# EAGLE design BMSafeMaster (EAGLE 5.08)
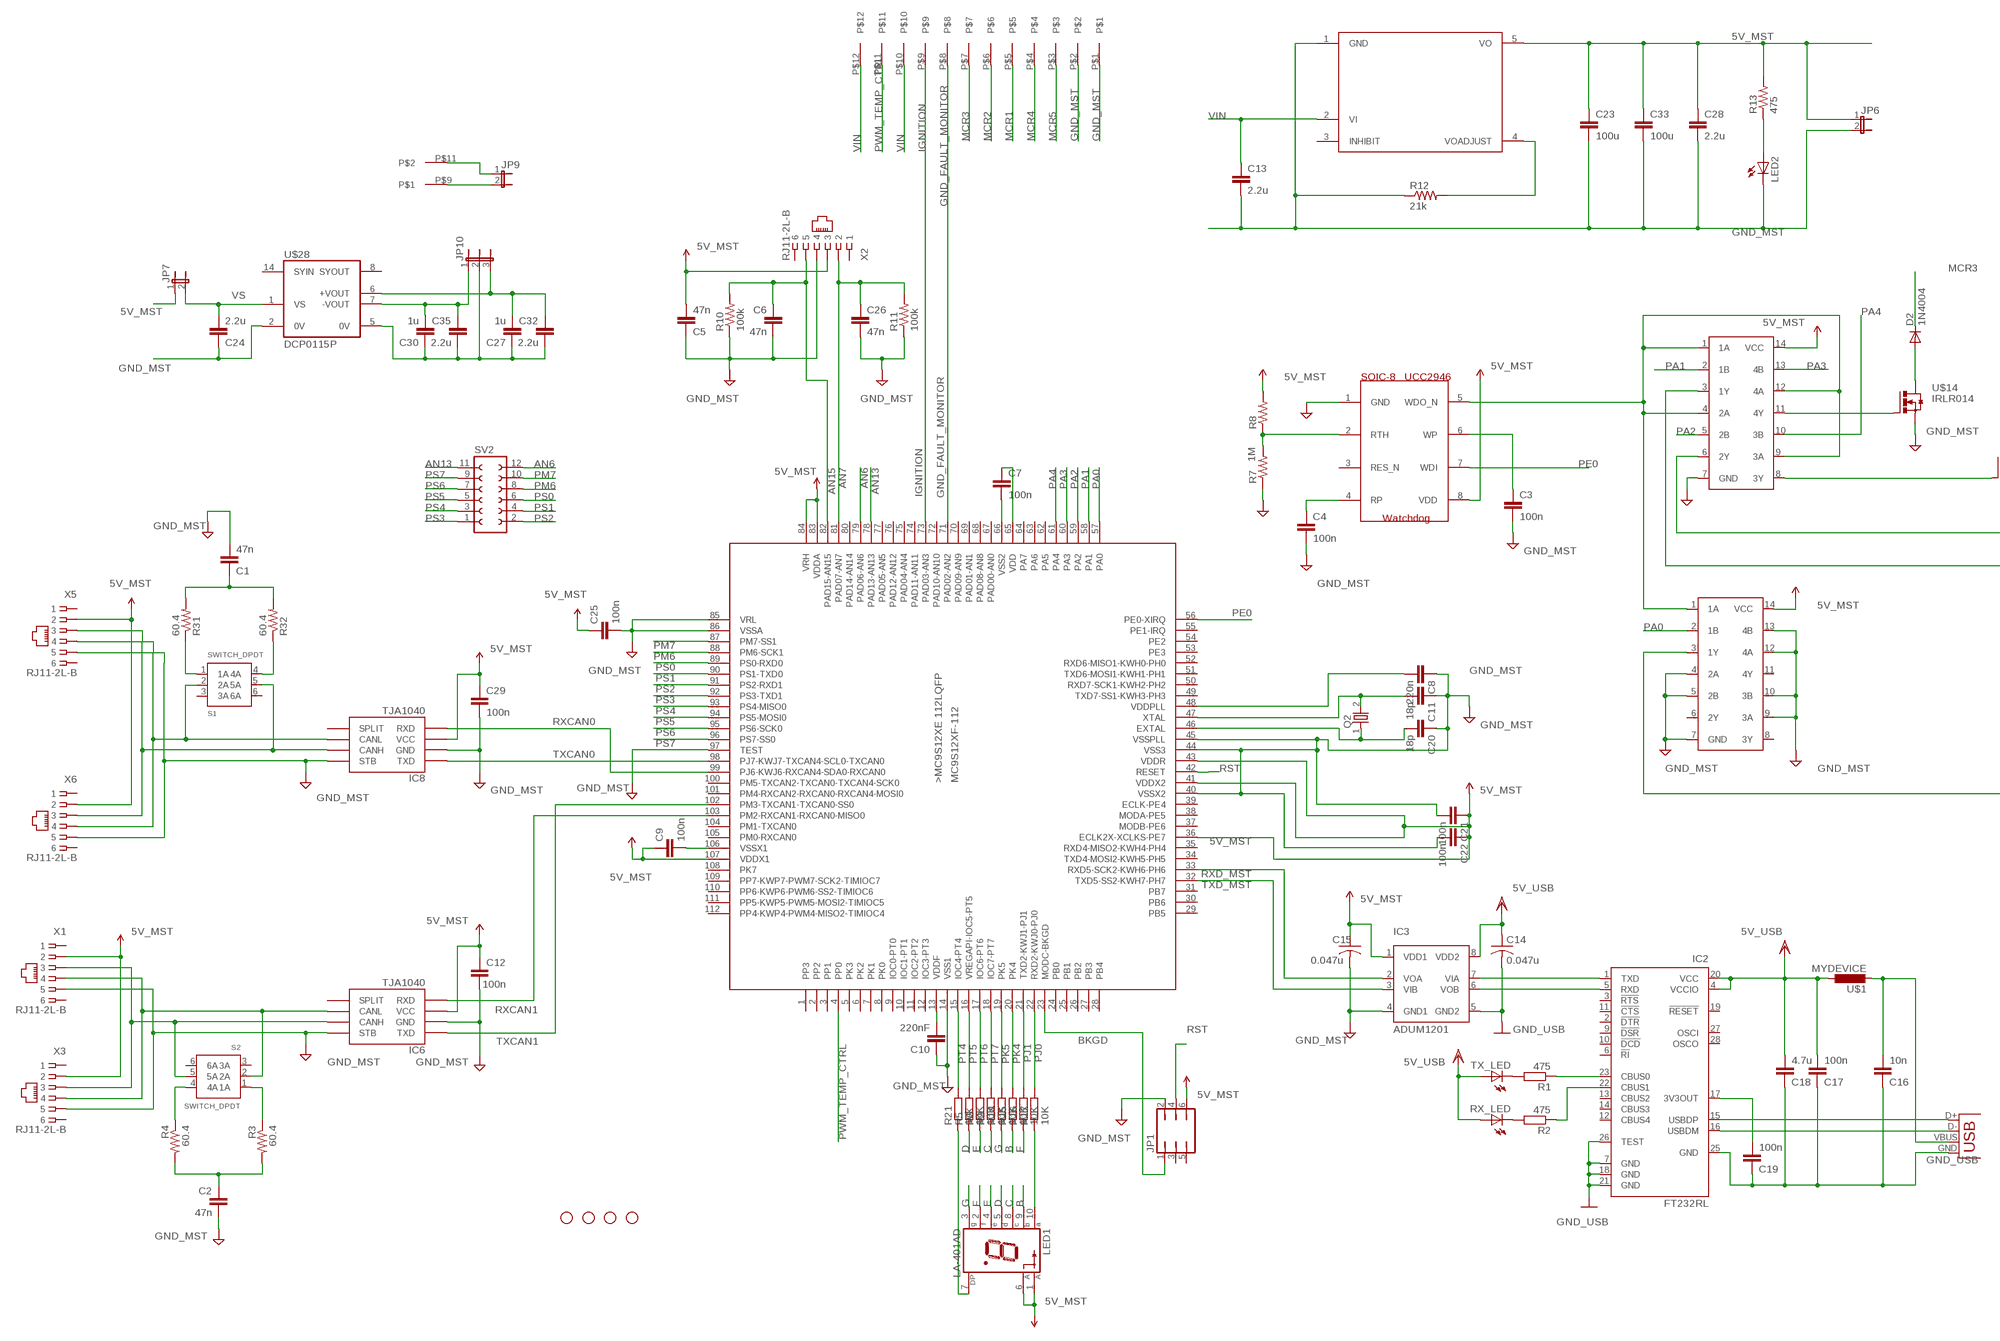
[diagram p0: schematic, sheet 1, part 1 of 2]
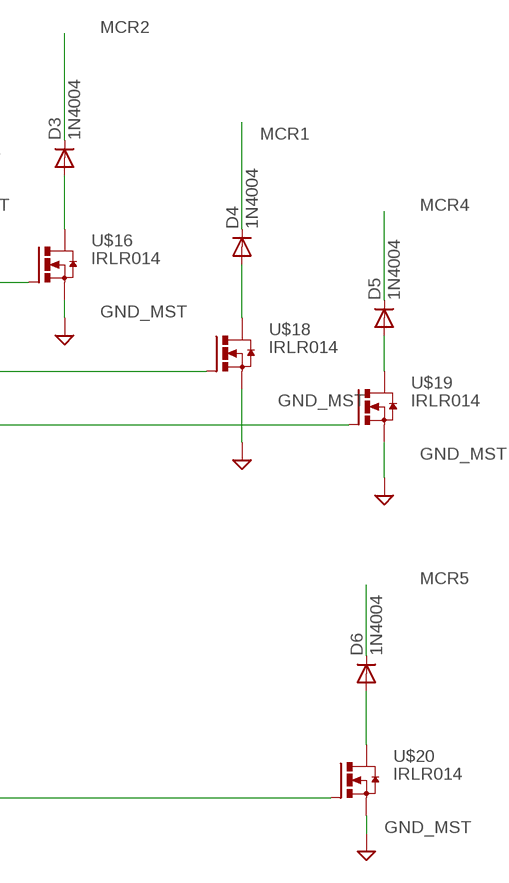
[diagram p1: schematic, sheet 1, part 2 of 2]

## Parts
C1  47n  C-EUC0805  [C0805]
C2  47n  C-EUC0805  [C0805]
C3  100n  C-EUC0805  [C0805]
C4  100n  C-EUC0805  [C0805]
C5  47n  C-EUC0805  [C0805]
C6  47n  C-EUC0805  [C0805]
C7  100n  C-EUC0805  [C0805]
C8  220n  C-EUC0805  [C0805]
C9  100n  C-EUC0805  [C0805]
C10  220nF  C-EUC0805  [C0805]
C11  18p  C-EUC0805  [C0805]
C12  100n  C-EUC0805  [C0805]
C13  2.2u  C-EUC1210  [C1210]
C14  0.047u  C-USC0805  [C0805]
C15  0.047u  C-USC0805  [C0805]
C16  10n  C-EUC0805  [C0805]
C17  100n  C-EUC0805  [C0805]
C18  4.7u  C-EUC1206  [C1206]
C19  100n  C-EUC0805  [C0805]
C20  18p  C-EUC0805  [C0805]
C21  100n  C-EUC0805  [C0805]
C22  100n  C-EUC0805  [C0805]
C23  100u  P12924  [EEU-FM1E101]
C24  2.2u  C-EUC1210  [C1210]
C25  100n  C-EUC0805  [C0805]
C26  47n  C-EUC0805  [C0805]
C27  1u  C-EU050-024X044  [C050-024X044]
C28  2.2u  C-EUC1210  [C1210]
C29  100n  C-EUC0805  [C0805]
C30  1u  C-EU050-024X044  [C050-024X044]
C32  2.2u  C-EUC1210  [C1210]
C33  100u  P12924  [EEU-FM1E101]
C35  2.2u  C-EUC1210  [C1210]
D2  1N4004  [DO41-10]
D3  1N4004  [DO41-10]
D4  1N4004  [DO41-10]
D5  1N4004  [DO41-10]
D6  1N4004  [DO41-10]
IC2  FT232RL  [SSOP28]
IC3  ADUM1201  [SOIC]
IC5  MC9S12XF-112  [SQFP-S-20X20-112]
IC6  TJA1040  [SO8]
IC8  TJA1040  [SO8]
J1  SCREWLESS_TERM_BLK2V2  [SCREWLESS2]
JP1  JP3Q  [JP3Q]
JP2  STAND-OFF  [STAND-OFF]
JP3  STAND-OFF  [STAND-OFF]
JP4  STAND-OFF  [STAND-OFF]
JP5  STAND-OFF  [STAND-OFF]
JP6  JP1E  [JP1]
JP7  JP1E  [JP1]
JP9  JP1E  [JP1]
JP10  JP2E  [JP2]
LED1  LA-401AD  [LA-401]
LED2  LEDSMT1206  [1206]
Q2  CSM-7X  [CSM-7X]
R1  475  R-EU_R0805  [R0805]
R2  475  R-EU_R0805  [R0805]
R3  60.4  R-US_R1206  [R1206]
R4  60.4  R-US_R1206  [R1206]
R5  10K  R-EU_R0805  [R0805]
R6  10K  R-EU_R0805  [R0805]
R7  1M  R-US_R0805  [R0805]
R8  1M  R-US_R0805  [R0805]
R9  10K  R-EU_R0805  [R0805]
R10  100k  R-US_R0805  [R0805]
R11  100k  R-US_R0805  [R0805]
R12  21k  R-US_R0805  [R0805]
R13  475  R-US_R0805  [R0805]
R14  10K  R-EU_R0805  [R0805]
R15  10K  R-EU_R0805  [R0805]
R16  10K  R-EU_R0805  [R0805]
R17  10K  R-EU_R0805  [R0805]
R21  10k  R-EU_R0805  [R0805]
R31  60.4  R-US_R1206  [R1206]
R32  60.4  R-US_R1206  [R1206]
RX_LED  LEDSMT1206  [1206]
S1  SWITCH_DPDT  [DPDT]
S2  SWITCH_DPDT  [DPDT]
SV2  FE06-2  [FE06-2]
TX_LED  LEDSMT1206  [1206]
U$1  MYDEVICE  [C0805]
U$3  SN74HC08  [TSSOP14]
U$10  WATCHDOG  [SOIC08]
U$11  SN74HC08  [TSSOP14]
U$13  SCREWLESS_TERM_BLK  [SCREWLESS]
U$14  IRLR014  [TO-252]
U$16  IRLR014  [TO-252]
U$18  IRLR014  [TO-252]
U$19  IRLR014  [TO-252]
U$20  IRLR014  [TO-252]
U$27  DCDCMAITRE_HOLES  [DCDCMAITRE_HOLES]
U$28  DCP0115P  [DIL14/7]
X1  RJ11-2L-B  [RJ11-NO_SHIELD]
X2  RJ11-2L-B  [RJ11-NO_SHIELD]
X3  RJ11-2L-B  [RJ11-NO_SHIELD]
X5  RJ11-2L-B  [RJ11-NO_SHIELD]
X6  RJ11-2L-B  [RJ11-NO_SHIELD]
X7  USBBMINIPTH  [USB-B-PTH]

## Nets
5V_MST: C5.2 C9.1 C12.1 C15.1 C21.1 C22.1 C23.1 C25.1 C28.1 C29.1 C33.1 IC3.1(VDD1) IC5.36(ECLK2X-XCLKS-PE7) IC5.41(VDDX2) IC5.43(VDDR) IC5.83(VDDA) IC5.84(VRH) IC5.107(VDDX1) IC6.3(VCC) IC8.3(VCC) JP1.6 JP6.1 JP7.1 LED1.1(A) LED1.6(A) R8.2 R13.2 U$3.14(VCC) U$10.8(VDD) U$11.14(VCC) U$27.5(VO) X1.2 X2.3 X3.2 X5.2 X6.2 ; supply symbol labelled 5V
5V_USB: C14.1 C17.2 C18.2 IC2.4(VCCIO) IC2.20(VCC) IC3.8(VDD2) RX_LED.A TX_LED.A U$1.1 ; supply symbol labelled VDD
+5V_ISO: C27.2 C32.1 JP10.3 U$28.6(+VOUT)
-5V_ISO: C30.2 C35.1 JP10.1 U$28.7(-VOUT)
AN6: IC5.79(PAD06-AN6) SV2.12
AN7: C26.1 IC5.81(PAD07-AN7) R11.2 X2.2
AN13: IC5.78(PAD13-AN13) SV2.11
AN15: C6.1 IC5.82(PAD15-AN15) R10.2 X2.5
B: LED1.9(B) R15.1
BKGD: IC5.23(MODC-BKGD) JP1.1
C: LED1.8(C) R9.1
CANH0: IC8.7(CANH) S1.5(5A) X5.3 X6.3
CANH1: IC6.7(CANH) S2.5(5A) X1.3 X3.3
CANL0: IC8.6(CANL) S1.2(2A) X5.4 X6.4
CANL1: IC6.6(CANL) S2.2(2A) X1.4 X3.4
D: LED1.5(D) R5.1
E: LED1.4(E) R6.1
EXTAL: C20.2 IC5.46(EXTAL) Q2.1
F: LED1.2(F) R16.1
G: LED1.3(G) R14.1
GM1: U$3.6(2Y) U$18.P$1(G)
GM2: U$3.8(3Y) U$16.P$1(G)
GM3: U$3.11(4Y) U$14.P$1(G)
GM4: U$3.3(1Y) U$19.P$1(G)
GM5: U$11.3(1Y) U$20.P$1(G)
GND_FAULT_MONITOR: IC5.71(PAD02-AN2) U$13.P$8
GND_MST: C1.2 C2.2 C3.2 C4.2 C5.1 C6.2 C7.2 C8.1 C9.2 C10.1 C11.1 C12.2 C13.2 C15.2 C20.1 C21.2 C22.2 C23.2 C24.1 C25.2 C26.2 C28.2 C29.2 C33.2 IC3.4(GND1) IC5.14(VSS1) IC5.40(VSSX2) IC5.44(VSS3) IC5.45(VSSPLL) IC5.66(VSS2) IC5.85(VRL) IC5.86(VSSA) IC5.97(TEST) IC5.106(VSSX1) IC6.2(GND) IC6.8(STB) IC8.2(GND) IC8.8(STB) JP1.2 JP6.2 LED2.C R7.1 R10.1 R11.1 R12.1 U$3.7(GND) U$10.1(GND) U$11.4(2A) U$11.5(2B) U$11.7(GND) U$11.9(3A) U$11.10(3B) U$11.12(4A) U$11.13(4B) U$13.P$1 U$13.P$2 U$14.P$3(S) U$16.P$3(S) U$18.P$3(S) U$19.P$3(S) U$20.P$3(S) U$27.1(GND) U$28.2(0V) X1.5 X2.4 X3.5 X5.5 X6.5 ; supply symbol labelled GND
GND_USB: C14.2 C16.1 C17.1 C18.1 C19.1 IC2.7(GND) IC2.18(GND) IC2.21(GND) IC2.25(GND) IC2.26(TEST) IC3.5(GND2) X7.GND ; supply symbol labelled 0V
HV_GND: C27.1 C30.1 C32.2 C35.2 JP10.2 U$28.5(0V)
IGNITION: IC5.73(PAD03-AN3) U$13.P$9
MCR1: D4.C U$13.P$5
MCR2: D3.C U$13.P$6
MCR3: D2.C U$13.P$7
MCR4: D5.C U$13.P$4
MCR5: D6.C U$13.P$3
N$2: R7.2 R8.1 U$10.2(RTH)
N$3: LED1.10(A) R17.1
N$5: C4.1 U$10.4(RP)
N$7: C3.1 U$10.6(WP)
N$8: LED2.A R13.1
N$12: J1.P$11 JP9.1
N$13: J1.P$9 JP9.2
N$18: C2.1 R3.2 R4.2
N$19: R3.1 S2.1(1A)
N$20: R4.1 S2.4(4A)
N$21: IC2.15(USBDP) X7.D+
N$22: IC2.16(USBDM) X7.D-
N$23: IC2.23(CBUS0) R1.1
N$24: R1.2 TX_LED.C
N$25: IC2.22(CBUS1) R2.1
N$26: R2.2 RX_LED.C
N$27: C19.2 IC2.17(3V3OUT)
N$29: C1.1 R31.2 R32.2
N$31: LED1.7(DP) R21.1
N$34: R31.1 S1.1(1A)
N$37: R32.1 S1.4(4A)
N$47: U$3.1(1A) U$3.4(2A) U$3.9(3A) U$3.12(4A) U$10.5(WDO_N) U$11.1(1A)
N$62: D6.A U$20.P$4(D)
N$63: D5.A U$19.P$4(D)
N$64: D4.A U$18.P$4(D)
N$65: D3.A U$16.P$4(D)
N$66: D2.A U$14.P$4(D)
PA0: IC5.57(PA0) U$11.2(1B)
PA1: IC5.58(PA1) U$3.2(1B)
PA2: IC5.59(PA2) U$3.5(2B)
PA3: IC5.60(PA3) U$3.13(4B)
PA4: IC5.61(PA4) U$3.10(3B)
PE0: IC5.56(PE0-XIRQ) U$10.7(WDI)
PJ0: IC5.22(RXD2-KWJ0-PJ0) R17.2
PJ1: IC5.21(TXD2-KWJ1-PJ1) R16.2
PK4: IC5.20(PK4) R15.2
PK5: IC5.19(PK5) R14.2
PM6: IC5.88(PM6-SCK1) SV2.8
PM7: IC5.87(PM7-SS1) SV2.10
PS0: IC5.89(PS0-RXD0) SV2.6
PS1: IC5.90(PS1-TXD0) SV2.4
PS2: IC5.91(PS2-RXD1) SV2.2
PS3: IC5.92(PS3-TXD1) SV2.1
PS4: IC5.93(PS4-MISO0) SV2.3
PS5: IC5.94(PS5-MOSI0) SV2.5
PS6: IC5.95(PS6-SCK0) SV2.7
PS7: IC5.96(PS7-SS0) SV2.9
PT4: IC5.15(IOC4-PT4) R21.2
PT5: IC5.16(VREGAPI-IOC5-PT5) R5.2
PT6: IC5.17(IOC6-PT6) R6.2
PT7: IC5.18(IOC7-PT7) R9.2
PWM_TEMP_CTRL: IC5.4(PP0) U$13.P$11
RST: IC5.42(RESET) JP1.4
RXCAN0: IC5.99(PJ6-KWJ6-RXCAN4-SDA0-RXCAN0) IC8.4(RXD)
RXCAN1: IC5.103(PM2-RXCAN1-RXCAN0-MISO0) IC6.4(RXD)
RXD_MST: IC3.2(VOA) IC5.33(RXD5-SCK2-KWH6-PH6)
RXD_USB: IC2.5(RXD) IC3.6(VOB)
TXCAN0: IC5.98(PJ7-KWJ7-TXCAN4-SCL0-TXCAN0) IC8.1(TXD)
TXCAN1: IC5.102(PM3-TXCAN1-TXCAN0-SS0) IC6.1(TXD)
TXD_MST: IC3.3(VIB) IC5.32(TXD5-SS2-KWH7-PH7)
TXD_USB: IC2.1(TXD) IC3.7(VIA)
VDD: C7.1 IC5.65(VDD)
VDDF: C10.2 IC5.13(VDDF)
VDDPLL: C8.2 IC5.48(VDDPLL)
VIN: C13.1 U$13.P$10 U$13.P$12 U$27.2(VI)
VOADJUST: R12.2 U$27.4(VOADJUST)
VS: C24.2 JP7.2 U$28.1(VS)
VUSB: C16.2 U$1.2 X7.VBUS
XTAL: C11.2 IC5.47(XTAL) Q2.2
Unconnected: IC2.2(!DTR) IC2.3(!RTS) IC2.6(!RI) IC2.9(!DSR) IC2.10(!DCD) IC2.11(!CTS) IC2.12(CBUS4) IC2.13(CBUS2) IC2.14(CBUS3) IC2.19(!RESET) IC2.27(OSCI) IC2.28(OSCO) IC5.1(PP3) IC5.2(PP2) IC5.3(PP1) IC5.5(PK3) IC5.6(PK2) IC5.7(PK1) IC5.8(PK0) IC5.9(IOC0-PT0) IC5.10(IOC1-PT1) IC5.11(IOC2-PT2) IC5.12(IOC3-PT3) IC5.24(PB0) IC5.25(PB1) IC5.26(PB2) IC5.27(PB3) IC5.28(PB4) IC5.29(PB5) IC5.30(PB6) IC5.31(PB7) IC5.34(TXD4-MOSI2-KWH5-PH5) IC5.35(RXD4-MISO2-KWH4-PH4) IC5.37(MODB-PE6) IC5.38(MODA-PE5) IC5.39(ECLK-PE4) IC5.49(TXD7-SS1-KWH3-PH3) IC5.50(RXD7-SCK1-KWH2-PH2) IC5.51(TXD6-MOSI1-KWH1-PH1) IC5.52(RXD6-MISO1-KWH0-PH0) IC5.53(PE3) IC5.54(PE2) IC5.55(PE1-IRQ) IC5.62(PA5) IC5.63(PA6) IC5.64(PA7) IC5.67(PAD00-AN0) IC5.68(PAD08-AN8) IC5.69(PAD01-AN1) IC5.70(PAD09-AN9) IC5.72(PAD10-AN10) IC5.74(PAD11-AN11) IC5.75(PAD04-AN4) IC5.76(PAD12-AN12) IC5.77(PAD05-AN5) IC5.80(PAD14-AN14) IC5.101(PM4-RXCAN2-RXCAN0-RXCAN4-MOSI0) IC5.104(PM1-TXCAN0) IC5.105(PM0-RXCAN0) IC5.108(PK7) IC5.109(PP7-KWP7-PWM7-SCK2-TIMIOC7) IC5.110(PP6-KWP6-PWM6-SS2-TIMIOC6) IC5.111(PP5-KWP5-PWM5-MOSI2-TIMIOC5) IC5.112(PP4-KWP4-PWM4-MISO2-TIMIOC4) IC6.5(SPLIT) IC8.5(SPLIT) JP1.3 JP1.5 S1.3(3A) S1.6(6A) S2.3(3A) S2.6(6A) U$10.3(RES_N) U$11.6(2Y) U$11.8(3Y) U$11.11(4Y) U$27.3(INHIBIT) U$28.8(SYOUT) U$28.14(SYIN) X1.1 X1.6 X2.1 X2.6 X3.1 X3.6 X5.1 X5.6 X6.1 X6.6

## Power pins joined to a net without a drawn wire
PM5-TXCAN2-TXCAN0-TXCAN4-SCK0: IC5.100(PM5-TXCAN2-TXCAN0-TXCAN4-SCK0)

## Library data of the parts
C1-C13 C16-C22 C24-C30 C32 C35 = rcl:C-EU: CAPACITOR, European symbol
C14 C15 = rcl:C-US: CAPACITOR, American symbol
C23 C33 = elc_n:P12924
D2-D6 = diode:1N4004: DIODE general purpose rectifier, 1 A
IC2 = ftdichip:FT232R: Source: http://www.ftdichip.com/Documents/DataSheets/DS_FT232R_v104.pdf
IC3 = adum1201:ADUM1201
IC5 = uCMaitre:MC9S12XF-112: MC9S12XF512 Source: www.freescale.com .. MC9S12XF512V1RM.pdf
IC6 IC8 = ELE4000_BMS:TJA1040
J1 = Screwless:SCREWLESS_TERM_BLK2V2
JP1 = jumper:JP3Q: JUMPER
JP2-JP5 = SparkFun:STAND-OFF: Stand Off This is the mechanical footprint for a #4 phillips button head screw. Use the keepout ring to avoid running the screw head into surrounding components. SKU : PRT-00447
JP6 JP7 JP9 = jumper:JP1E: JUMPER
JP10 = jumper:JP2E: JUMPER
LED1 = led-7-segment:LA-401*D: Single Digit LED Numeric Display (anode common) Source: ROHM .. la-1401dn.pdf
LED2 RX_LED TX_LED = led:LED: LED OSRAM: - CHIPLED LG R971, LG N971, LY N971, LG Q971, LY Q971, LO R971, LY R971 LH N974, LH R974 LS Q976, LO Q976, LY Q976 LO Q996 - Hyper CHIPLED LW Q18S LB Q993, LB Q99A, LB R99A - SideLED LS A670, LO A670, LY A670, LG A670, LP A670 LB A673, LV A673, LT A673, LW A673 LH A674 LY A675 LS A676, LA A676, LO A676, LY A676, LW A676 LS A679, LY A679, LG A679 - Hyper Micro SIDELED® LS Y876, LA Y876, LO Y876, LY Y876 LT Y87S - SmartLED LW L88C, LW L88S LB L89C, LB L89S, LG L890 LS L89K, LO L89K, LY L89K LS L896, LA L896, LO L896, LY L896 - TOPLED LS T670, LO T670, LY T670, LG T670, LP T670 LSG T670, LSP T670, LSY T670, LOP T670, LYG T670 LG T671, LOG T671, LSG T671 LB T673, LV T673, LT T673, LW T673 LH T674 LS T676, LA T676, LO T676, LY T676, LB T676, LH T676, LSB T676, LW T676 LB T67C, LV T67C, LT T67C, LS T67K, LO T67K, LY T67K, LW E67C LS E67B, LA E67B, LO E67B, LY E67B, LB E67C, LV E67C, LT E67C LW T67C LS T679, LY T679, LG T679 LS T770, LO T770, LY T770, LG T770, LP T770 LB T773, LV T773, LT T773, LW T773 LH T774 LS E675, LA E675, LY E675, LS T675 LS T776, LA T776, LO T776, LY T776, LB T776 LHGB T686 LT T68C, LB T68C - Hyper Mini TOPLED® LB M676 - Mini TOPLED Santana® LG M470 LS M47K, LO M47K, LY M47K Source: http://www.osram.convergy.de LUXEON: - LUMILED® LXK2-PW12-R00, LXK2-PW12-S00, LXK2-PW14-U00, LXK2-PW14-V00 LXK2-PM12-R00, LXK2-PM12-S00, LXK2-PM14-U00 LXK2-PE12-Q00, LXK2-PE12-R00, LXK2-PE12-S00, LXK2-PE14-T00, LXK2-PE14-U00 LXK2-PB12-K00, LXK2-PB12-L00, LXK2-PB12-M00, LXK2-PB14-N00, LXK2-PB14-P00, LXK2-PB14-Q00 LXK2-PR12-L00, LXK2-PR12-M00, LXK2-PR14-Q00, LXK2-PR14-R00 LXK2-PD12-Q00, LXK2-PD12-R00, LXK2-PD12-S00 LXK2-PH12-R00, LXK2-PH12-S00 LXK2-PL12-P00, LXK2-PL12-Q00, LXK2-PL12-R00 Source: www.luxeon.com KINGBRIGHT: KA-3528ASYC Source: www.kingbright.com
Q2 = ELE4000_BMS:CSM-7X
R1 R2 R5 R6 R9 R14-R17 R21 = rcl:R-EU_: RESISTOR, European symbol
R3 R4 R7 R8 R10-R13 R31 R32 = rcl:R-US_: RESISTOR, American symbol
S1 S2 = ELE4000_BMS:SWITCH_DPDT
SV2 = con-lsta:FE06-2: FEMALE HEADER
U$1 = rcl:MYDEVICE: MI0805K400R-10 Ferrite bead
U$3 U$11 = sn74hc08:SN74HC08: Quad And gate sn74hc08-q1
U$10 = Watchdog:WATCHDOG
U$13 = Screwless:SCREWLESS_TERM_BLK
U$14 U$16 U$18-U$20 = transistor-power:IRLR014
U$27 = PTN78000W:DCDCMAITRE_HOLES
U$28 = DCP0105:DCP0115: DC/DC Converters Miniature 15V Input, 1W Isolated Unregulated
X1-X3 X5 X6 = con-tycoelectronics:RJ11: CORCOM Modular RJ Jacks No Shield Source: www.tycoelectronics.com .. ENG_DS_1654001_1099_RJ_L_0507.pdf
X7 = SparkFun:USBBMINI: USB Connectors USB-B-PTH is fully proven SKU : PRT-00139 USB-miniB is fully proven SKU : PRT-00587 USB-A-PCB is untested. USB-A-H is throughly reviewed, but untested. Spark Fun Electronics SKU : PRT-00437 USB-B-SMT is throughly reviewed, but untested. Needs silkscreen touching up. USB-A-S has not been used/tested USB-MB-H has not been used/tested

## Board
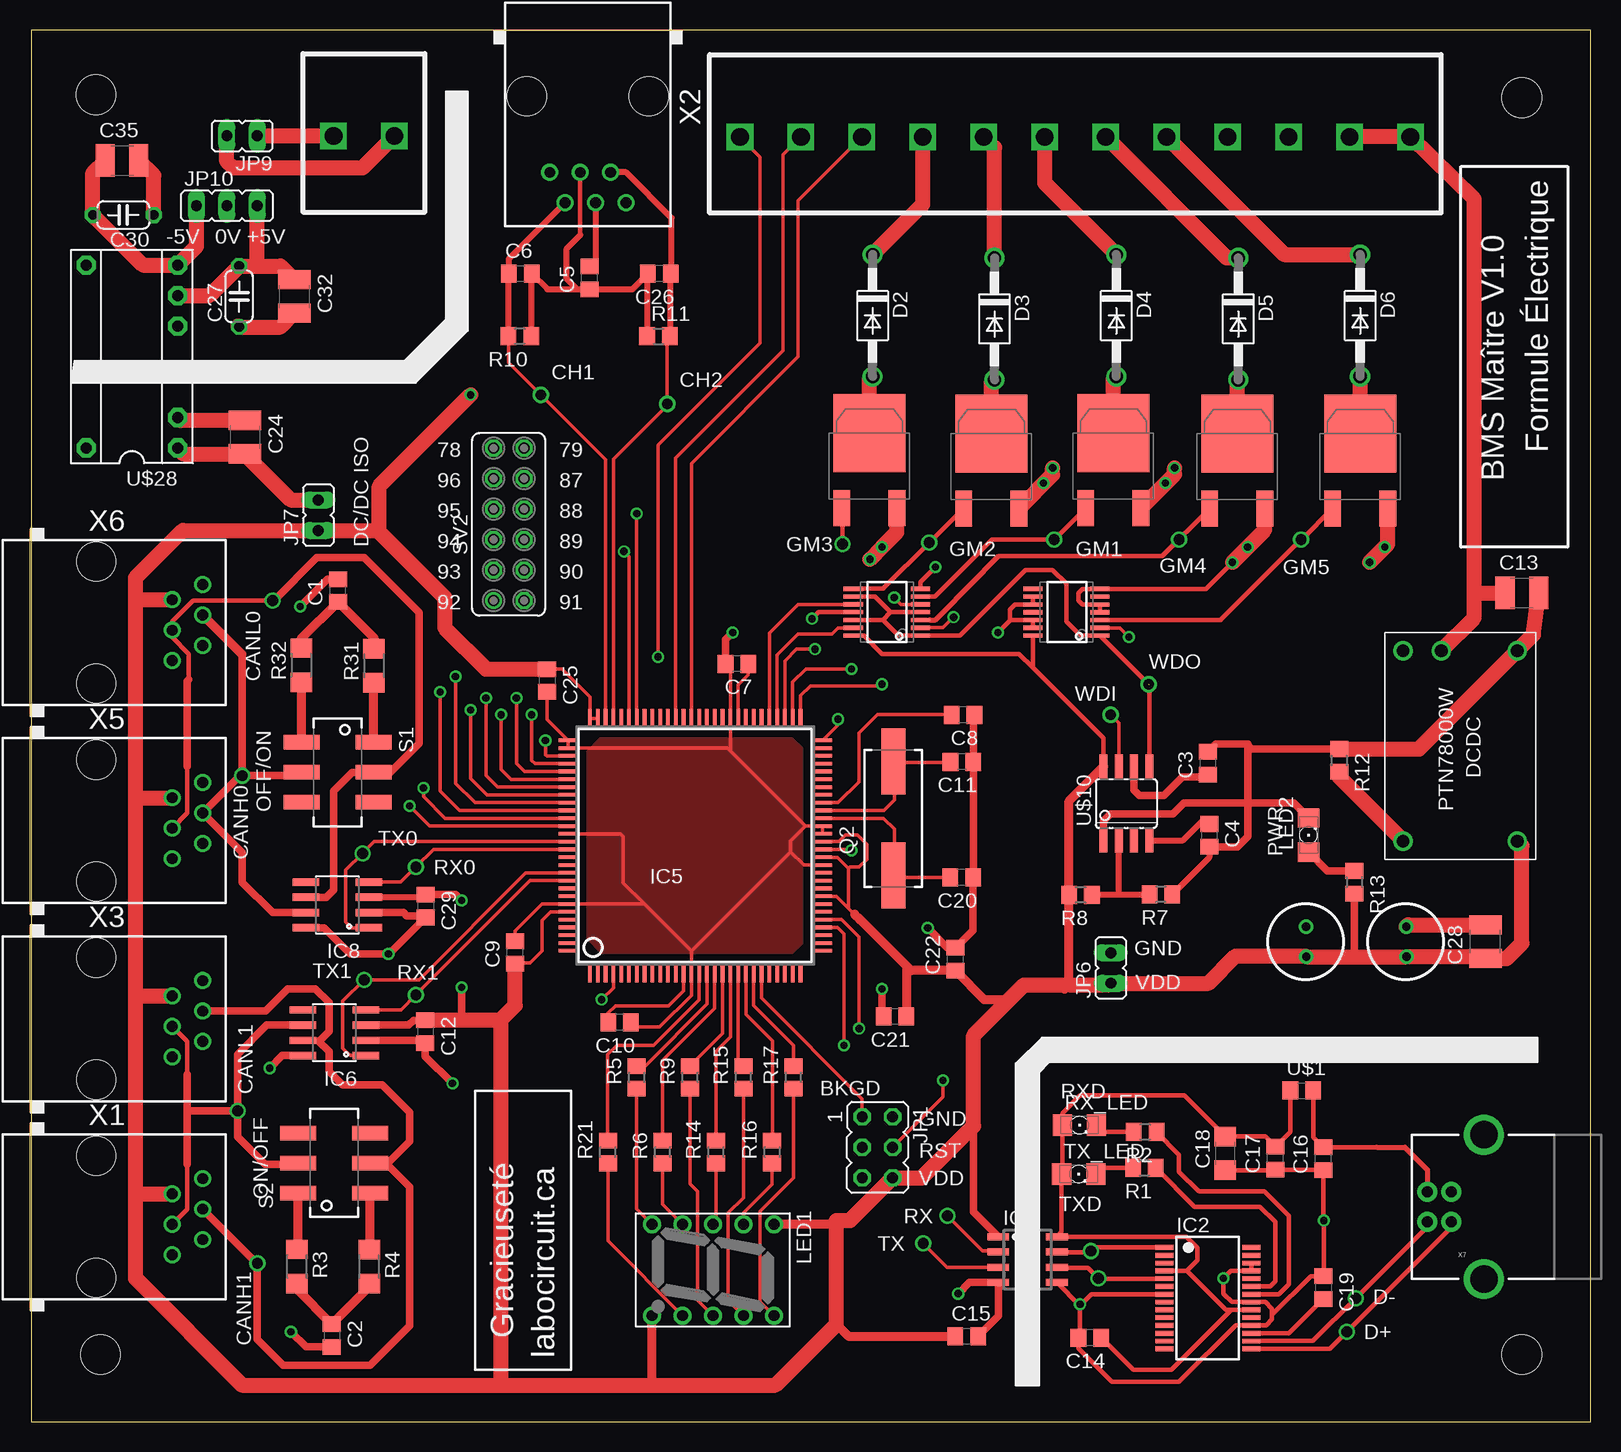
[diagram p2: board, top side]
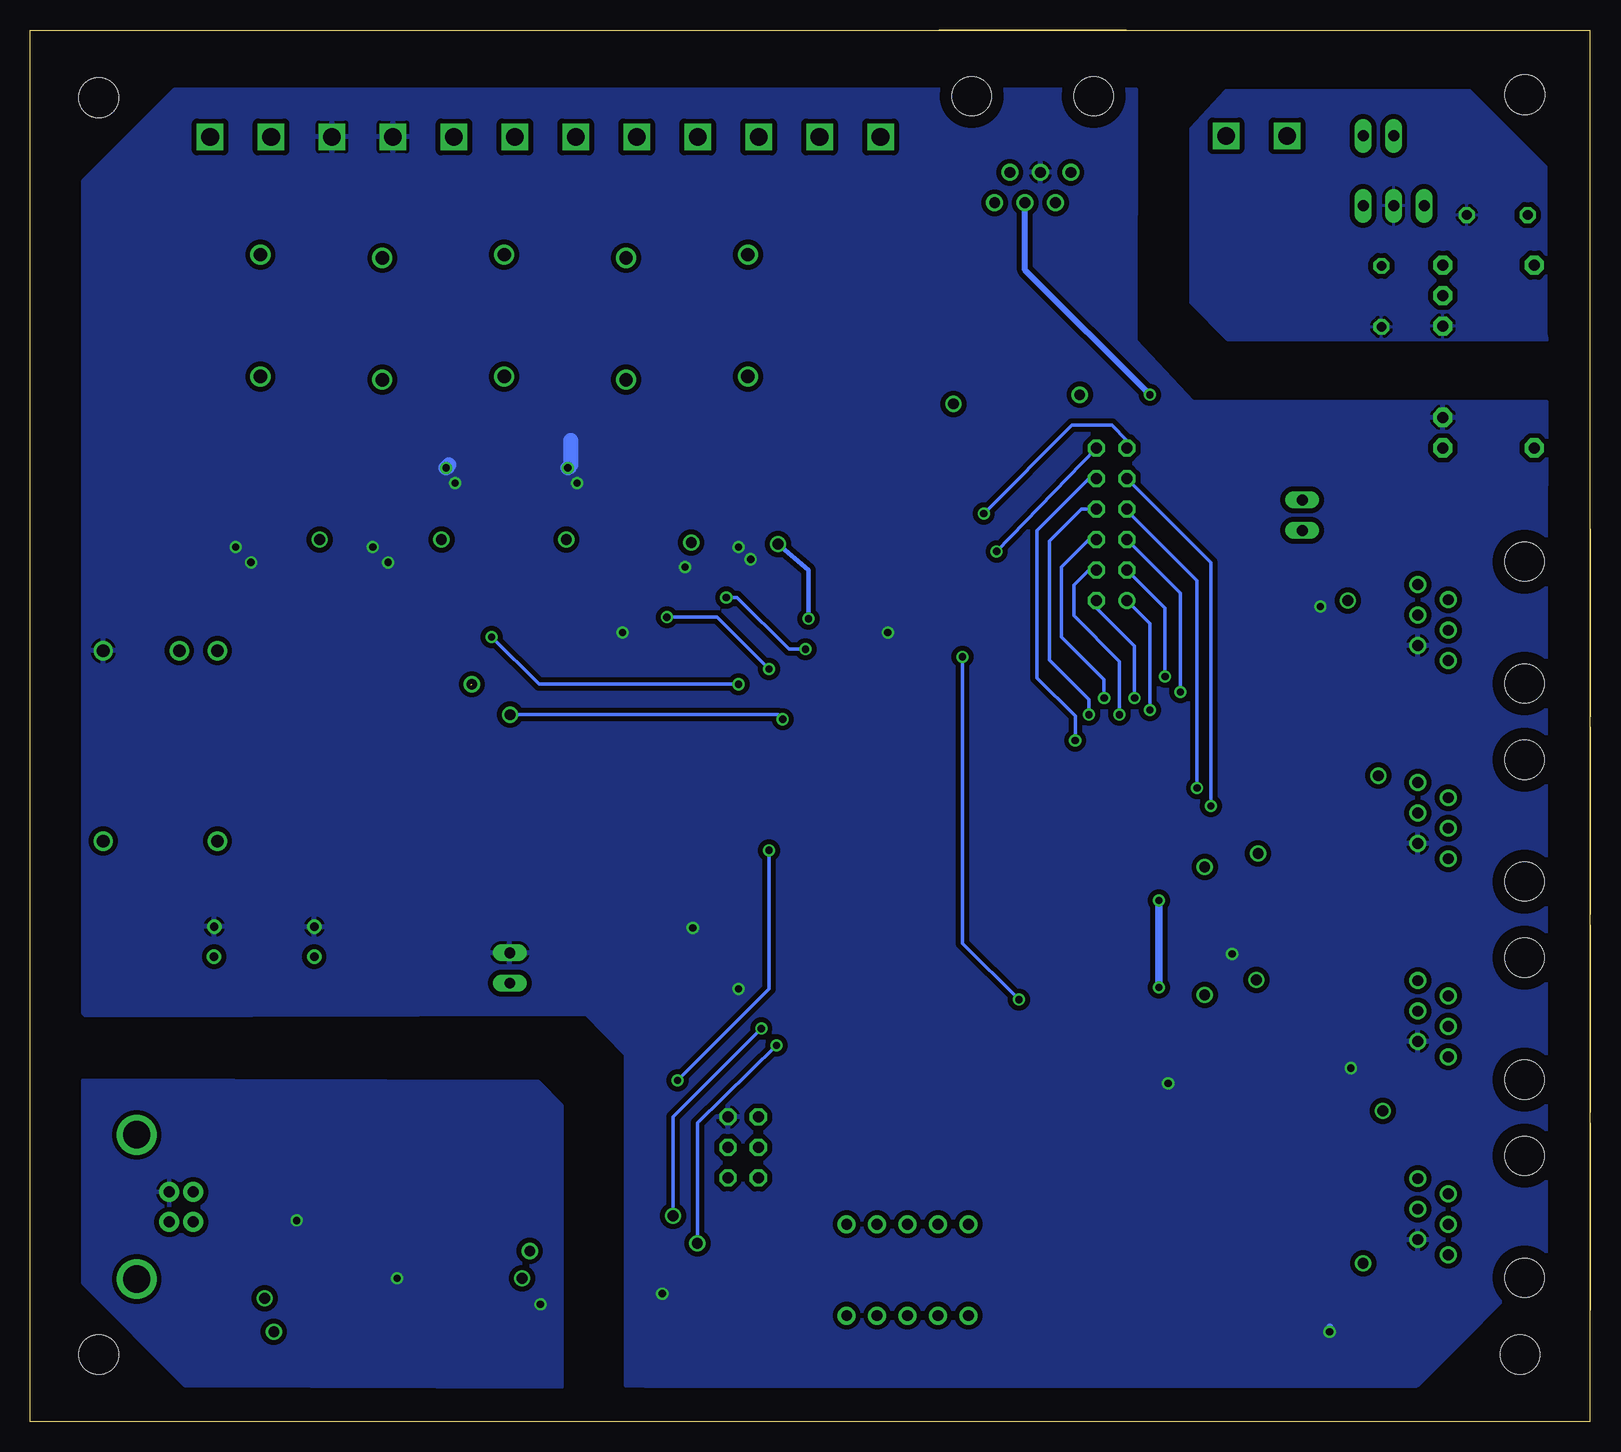
[diagram p3: board, bottom side, seen from below]

Size 130.09 x 116 mm. Coordinates in mm from the lower left corner, seen from the top.
Copper layers (1*16): Top 0.035mm / dielectric 1.5mm / Bottom 0.035mm
Design rules "default": minimum track width 10mil, minimum drill 0.6mm, track to track 8mil, track to pad 8mil, pad to pad 8mil, via to via 8mil, smd to smd 8mil, copper to edge 40mil, drill to drill 8mil, minimum pad ring 10mil, minimum via ring 8mil, stop-mask expansion 4mil, vias tented up to drill 0mil, thermal gap 10mil

### Footprints (pad centres in the part's own frame; a part is rotated, then mirrored left to right if it is on the bottom)
C0805 = smd 1.3 x 1.5: 1 -0.95,0; 2 0.95,0
C1210 = smd 1.6 x 2.7: 1 -1.4,0; 2 1.4,0
C1206 = smd 1.6 x 1.8: 1 -1.4,0; 2 1.4,0
EEU-FM1E101 = drill 0.7 round: 1 -1.25,-0.06; 2 1.25,-0.05
C050-024X044 = drill 0.813 octagon: 1 -2.54,0; 2 2.54,0
DO41-10 = drill 1.118 round: A 5.08,0; C -5.08,0
SSOP28 = smd 0.4 x 1.5: 1 -4.225,-3.625; 2 -3.575,-3.625; 3 -2.925,-3.625; 4 -2.275,-3.625; 5 -1.625,-3.625; 6 -0.975,-3.625; 7 -0.325,-3.625; 8 0.325,-3.625; 9 0.975,-3.625; 10 1.625,-3.625; 11 2.275,-3.625; 12 2.925,-3.625; 13 3.575,-3.625; 14 4.225,-3.625; 15 4.225,3.625; 16 3.575,3.625; 17 2.925,3.625; 18 2.275,3.625; 19 1.625,3.625; 20 0.975,3.625; 21 0.325,3.625; 22 -0.325,3.625; 23 -0.975,3.625; 24 -1.625,3.625; 25 -2.275,3.625; 26 -2.925,3.625; 27 -3.575,3.625; 28 -4.225,3.625
SOIC = smd 0.6 x 1.8: 1 -1.905,-2.44; 2 -0.635,-2.44; 3 0.635,-2.44; 4 1.905,-2.44; 5 1.905,2.44; 6 0.635,2.44; 7 -0.635,2.44; 8 -1.905,2.44
SQFP-S-20X20-112 = smd 0.3 x 1.6: 1 -8.775,-10.6; 2 -8.125,-10.6; 3 -7.475,-10.6; 4 -6.825,-10.6; 5 -6.175,-10.6; 6 -5.525,-10.6; 7 -4.875,-10.6; 8 -4.225,-10.6; 9 -3.575,-10.6; 10 -2.925,-10.6; 11 -2.275,-10.6; 12 -1.625,-10.6; 13 -0.975,-10.6; 14 -0.325,-10.6; 15 0.325,-10.6; 16 0.975,-10.6; 17 1.625,-10.6; 18 2.275,-10.6; 19 2.925,-10.6; 20 3.575,-10.6; 21 4.225,-10.6; 22 4.875,-10.6; 23 5.525,-10.6; 24 6.175,-10.6; 25 6.825,-10.6; 26 7.475,-10.6; 27 8.125,-10.6; 28 8.775,-10.6; 57 8.775,10.6; 58 8.125,10.6; 59 7.475,10.6; 60 6.825,10.6; 61 6.175,10.6; 62 5.525,10.6; 63 4.875,10.6; 64 4.225,10.6; 65 3.575,10.6; 66 2.925,10.6; 67 2.275,10.6; 68 1.625,10.6; 69 0.975,10.6; 70 0.325,10.6; 71 -0.325,10.6; 72 -0.975,10.6; 73 -1.625,10.6; 74 -2.275,10.6; 75 -2.925,10.6; 76 -3.575,10.6; 77 -4.225,10.6; 78 -4.875,10.6; 79 -5.525,10.6; 80 -6.175,10.6; 81 -6.825,10.6; 82 -7.475,10.6; 83 -8.125,10.6; 84 -8.775,10.6 | smd 1.6 x 0.3: 29 10.6,-8.775; 30 10.6,-8.125; 31 10.6,-7.475; 32 10.6,-6.825; 33 10.6,-6.175; 34 10.6,-5.525; 35 10.6,-4.875; 36 10.6,-4.225; 37 10.6,-3.575; 38 10.6,-2.925; 39 10.6,-2.275; 40 10.6,-1.625; 41 10.6,-0.975; 42 10.6,-0.325; 43 10.6,0.325; 44 10.6,0.975; 45 10.6,1.625; 46 10.6,2.275; 47 10.6,2.925; 48 10.6,3.575; 49 10.6,4.225; 50 10.6,4.875; 51 10.6,5.525; 52 10.6,6.175; 53 10.6,6.825; 54 10.6,7.475; 55 10.6,8.125; 56 10.6,8.775; 85 -10.6,8.775; 86 -10.6,8.125; 87 -10.6,7.475; 88 -10.6,6.825; 89 -10.6,6.175; 90 -10.6,5.525; 91 -10.6,4.875; 92 -10.6,4.225; 93 -10.6,3.575; 94 -10.6,2.925; 95 -10.6,2.275; 96 -10.6,1.625; 97 -10.6,0.975; 98 -10.6,0.325; 99 -10.6,-0.325; 100 -10.6,-0.975; 101 -10.6,-1.625; 102 -10.6,-2.275; 103 -10.6,-2.925; 104 -10.6,-3.575; 105 -10.6,-4.225; 106 -10.6,-4.875; 107 -10.6,-5.525; 108 -10.6,-6.175; 109 -10.6,-6.825; 110 -10.6,-7.475; 111 -10.6,-8.125; 112 -10.6,-8.775
SO8 = smd 0.61 x 2.21: 1 -1.905,-2.616; 2 -0.635,-2.616; 3 0.635,-2.616; 4 1.905,-2.616; 5 1.905,2.616; 6 0.635,2.616; 7 -0.635,2.616; 8 -1.905,2.616
SCREWLESS2 = drill 1.473 square: P$9 2.54,0; P$11 -2.54,0
JP3Q = drill 0.914 octagon: 1 -2.54,-1.27; 2 -2.54,1.27; 3 0,-1.27; 4 0,1.27; 5 2.54,-1.27; 6 2.54,1.27
STAND-OFF = hole 3.302: 0,0
JP1 = drill 0.914 long: 1 0,-1.27; 2 0,1.27
JP2 = drill 0.914 long: 1 -2.54,0; 2 0,0; 3 2.54,0
LA-401 = drill 0.9 pad 1.5 round: 1 -3.81,5.08; 2 -3.81,2.54; 3 -3.81,0; 4 -3.81,-2.54; 5 -3.81,-5.08; 6 3.81,-5.08; 7 3.81,-2.54; 8 3.81,0; 9 3.81,2.54; 10 3.81,5.08
1206 = smd 1.6 x 1.803: A -1.422,0; C 1.422,0
CSM-7X = smd 5.5 x 2: 1 -4.75,0; 2 4.75,0
R0805 = smd 1.3 x 1.5: 1 -0.95,0; 2 0.95,0
R1206 = smd 1.6 x 1.803: 1 -1.422,0; 2 1.422,0
DPDT = smd 1.2 x 3: 1 -2.5,3; 2 0,3; 3 2.5,3; 4 -2.5,-3; 5 0,-3; 6 2.5,-3
FE06-2 = drill 0.914 round: 1 -6.35,1.27 | drill 0.914 octagon: 2 -6.35,-1.27; 3 -3.81,1.27; 4 -3.81,-1.27; 5 -1.27,1.27; 6 -1.27,-1.27; 7 1.27,1.27; 8 1.27,-1.27; 9 3.81,1.27; 10 3.81,-1.27; 11 6.35,1.27; 12 6.35,-1.27
TSSOP14 = smd 0.35 x 1.6: 1 -1.95,-2.8; 2 -1.3,-2.8; 3 -0.65,-2.8; 4 0,-2.8; 5 0.65,-2.8; 6 1.3,-2.8; 7 1.95,-2.8; 8 1.95,2.8; 9 1.3,2.8; 10 0.65,2.8; 11 0,2.8; 12 -0.65,2.8; 13 -1.3,2.8; 14 -1.95,2.8
SOIC08 = smd 0.66 x 2.032: 1 -1.905,-3.073; 2 -0.635,-3.073; 3 0.635,-3.073; 4 1.905,-3.073; 5 1.905,3.073; 6 0.635,3.073; 7 -0.635,3.073; 8 -1.905,3.073
SCREWLESS = drill 1.473 square: P$1 48.26,6.35; P$2 43.18,6.35; P$3 38.1,6.35; P$4 33.02,6.35; P$5 27.94,6.35; P$6 22.86,6.35; P$7 17.78,6.35; P$8 12.7,6.35; P$9 7.62,6.35; P$10 58.42,6.35; P$11 2.54,6.35; P$12 53.34,6.35
TO-252 = smd 1.4 x 3: P$1 -2.3,-6.25; P$3 2.3,-6.25 | smd 6 x 6.5: P$4 0,0
DCDCMAITRE_HOLES = drill 1.067 round: 1 -7.874,4.699; 2 -7.874,-1.651; 3 -7.874,-4.826; 4 8.001,-4.826; 5 8.001,4.699
DIL14/7 = drill 0.914 pad 1.6 octagon: 1 -7.62,-3.81; 2 -5.08,-3.81; 5 2.54,-3.81; 6 5.08,-3.81; 7 7.62,-3.81; 8 7.62,3.81; 14 -7.62,3.81
RJ11-NO_SHIELD = drill 0.9 pad 1.4 round: 1 -3.175,8.89; 2 -1.905,6.35; 3 -0.635,8.89; 4 0.635,6.35; 5 1.905,8.89; 6 3.175,6.35 | hole 3.251: -5.08,0; 5.08,0
USB-B-PTH = drill 0.914 pad 1.676 round: D+ 0,1.25; D- 1.981,1.25; GND 0,-1.25; VBUS 1.981,-1.25 | drill 2.286 round: P$1 -2.718,-6.02; P$2 -2.718,6.02

### Placement (x,y rotation side)
C1  25.67,69.27 90 top
C2  25.16,7.17 270 top
C3  98.21,54.87 90 top
C4  98.3,48.87 270 top
C5  46.66,95.34 90 top
C6  40.88,95.7 0 top
C7  58.93,63.16 180 top
C8  77.78,58.9 180 top
C9  40.44,39.1 90 top
C10  49.15,33.27 180 top
C11  77.68,55 180 top
C12  32.95,32.51 270 top
C13  124.37,69.08 0 top
C14  88.35,6.97 180 top
C15  78.08,7.12 0 top
C16  107.8,21.91 90 top
C17  103.81,21.96 90 top
C18  99.64,22.35 90 top
C19  107.82,11.18 270 top
C20  77.66,45.34 180 top
C21  72.1,33.75 180 top
C22  77.14,38.53 90 top
C23  106.33,40 90 top
C24  17.92,82.06 270 top
C25  43.11,61.77 270 top
C26  52.46,95.67 180 top
C27  17.43,93.79 90 top
C28  121.32,40 90 top
C29  32.98,42.97 270 top
C30  7.78,100.58 180 top
C32  22.03,93.78 270 top
C33  114.68,40.01 90 top
C35  7.67,105.12 0 top
D2  70.24,92.19 270 top
D3  80.4,91.92 270 top
D4  90.56,92.19 270 top
D5  100.72,91.92 270 top
D6  110.88,92.19 270 top
IC2  98.18,10.29 270 top
IC3  83.16,13.5 270 top
IC5  55.46,48.01 0 top
IC6  25.37,32.41 90 top
IC8  25.63,43.06 90 top
J1  27.85,107.18 0 top
JP1  70.64,22.85 270 top
JP2  5.87,5.58 0 top
JP3  124.37,5.58 0 top
JP4  5.49,110.61 0 top
JP5  124.37,110.36 0 top
JP6  90.09,37.81 0 top
JP7  24.04,75.56 0 top
JP9  17.69,107.18 90 top
JP10  16.42,101.34 0 top
LED1  56.93,12.64 270 top
LED2  106.59,48.89 90 top
Q2  71.97,50.28 90 top
R1  92.9,21.13 180 top
R2  92.95,24.13 180 top
R3  22.25,12.93 270 top
R4  28.29,12.91 270 top
R5  50.58,28.69 90 top
R6  52.74,22.47 90 top
R7  94.27,43.93 180 top
R8  87.57,43.9 180 top
R9  55.03,28.69 90 top
R10  40.83,90.46 180 top
R11  52.39,90.46 0 top
R12  109.13,55.11 270 top
R13  110.4,44.95 270 top
R14  57.18,22.47 90 top
R15  59.47,28.69 90 top
R16  61.87,22.47 90 top
R17  63.65,28.69 90 top
R21  48.17,22.47 90 top
R31  28.67,63 90 top
R32  22.62,63.05 90 top
RX_LED  87.48,24.72 0 top
S1  25.63,54.11 270 top
S2  25.37,21.55 90 top
SV2  39.91,74.8 90 top
TX_LED  87.42,20.64 0 top
U$1  106.01,27.59 0 top
U$3  71.43,67.48 90 top
U$10  91.39,51.52 0 top
U$11  86.4,67.46 90 top
U$13  56.65,100.73 0 top
U$14  69.97,82.38 0 top
U$16  80.13,82.35 0 top
U$18  90.3,82.38 0 top
U$19  100.64,82.35 0 top
U$20  110.88,82.35 0 top
U$27  119.29,56.38 270 top
U$28  8.49,88.78 90 top
X1  5.51,17.07 270 top
X2  46.5,110.48 180 top
X3  5.51,33.58 270 top
X5  5.51,50.09 270 top
X6  5.51,66.6 270 top
X7  118.47,17.88 180 top

### Tracks (layer width: path | path; a pad name or v marks a point on that pad's centre or on a via)
5V_MST  (via drill 0.6)
  Top 0.305: IC5.83 IC5.84 46.68,60.41 44.36,62.72 C25.1 | IC5.36 67.24,43.78 68.74,42.28 | 68.23,46.1 68.23,42.79 69.18,41.84 | 68.23,46.1 67.3,47.03 IC5.41 | IC5.43 67.43,48.34 67.98,48.89 68.99,48.89 69.76,48.12 69.76,46.85 69.12,46.22 68.35,46.22 68.23,46.1 | IC5.107 43.41,42.49 42.7,41.78 42.7,39.24 41.69,38.22 40.5,38.22 C9.1
  Top 0.381: U$3.14 69.5,65.53 71.03,64 82.46,64 83.6,62.86 | U$10.8 89.49,56.97 83.6,62.86 | 83.6,62.86 U$11.14
  Top 0.508: IC8.3 32.75,43.7 C29.1 | C5.2 47.14,96.77 X2.3
  Top 0.635: IC6.3 31.56,33.04 31.97,33.46 C12.1 | C29.1 35.48,43.92 v35.97,43.43 | v35.97,36.19 35.97,33.97 35.47,33.46 | IC3.1 78.65,17.48 78.65,24.63 | 110.4,38.75 R13.2
  Top 0.762: 81.62,35.16 79.56,35.16 C22.1 73.44,37.59 73.05,37.97 | 73.05,37.97 C21.1 | 73.05,37.97 69.18,41.84 68.74,42.28 | U$10.8 86.62,51.73 R8.2 86.62,36.41 86.27,36.06 86.27,36.38 | C15.1 68.22,7.12 67.22,8.12 | LED1.1 66.91,16.45 67.22,16.76 | LED1.6 51.85,3.17 51.72,3.04
  Top 1.27: 39.28,3.04 17.69,3.04 8.8,11.93 8.8,18.91 | 39.28,3.04 51.72,3.04 62.14,3.04 67.22,8.12 67.22,16.76 68.36,16.76 JP1.6 74.33,20.31 78.65,24.63 78.65,32.19 81.62,35.16 82.84,36.38 86.27,36.38 | 8.8,18.91 8.8,35.3 | 8.8,35.3 8.8,51.94 | 8.8,51.94 8.8,68.7 | 8.8,68.7 8.8,70.35 12.73,74.29 JP7.1 28.99,74.29 29.12,74.16 | 29.12,74.16 34.58,68.7 34.58,66.16 38.01,62.72 C25.1 | X1.2 8.86,18.98 8.8,18.91 | X3.2 8.98,35.49 8.8,35.3 | X5.2 8.86,52 8.8,51.94 | X6.2 8.99,68.51 8.8,68.7 | 39.28,3.04 39.28,33.52 | C12.1 35.47,33.46 39.21,33.46 39.28,33.52 | 39.28,33.52 40.44,34.68 C9.1 | 121.83,38.6 121.82,38.6 C28.1 121.16,38.76 C33.1 114.73,38.75 110.4,38.75 C23.1 106.35,38.79 100.49,38.79 98.24,36.54 JP6.1 89.96,36.41 86.62,36.41 | U$27.5 124.37,48 124.37,39.87 123.1,38.6 121.83,38.6 | 121.83,38.6 120.56,38.6 | 29.12,74.16 29.12,77.97 v36.74,85.59
  Bottom 0.406: X2.3 47.09,101.64
  Bottom 0.508: v36.74,85.59 47.14,95.99 X2.3
  Bottom 0.635: v35.97,36.19 v35.97,43.43
5V_USB
  Top 0.381: U$1.1 105.06,24.15 C17.2 102.97,23.75 C18.2 96.22,27.17 87.54,27.17 86.06,25.7 RX_LED.A 86.06,20.7 TX_LED.A 86,15.8 IC3.8 96.38,15.41 97.31,14.47 97.31,13.45 96.43,12.56 | 96.43,12.56 IC2.4 | C14.1 91.96,4.31 95.16,4.31 100.16,9.31 | 100.16,9.31 100.24,9.31 IC2.20 | 96.43,12.56 99.68,9.31 100.16,9.31
+5V_ISO
  Top 1.27: U$28.6 14.97,93.86 C27.2 18.96,96.33 | 18.96,96.33 20.89,96.33 C32.1 | 18.96,96.33 JP10.3
-5V_ISO
  Top 1.27: C35.1 5.24,104.09 C30.2 9.41,96.4 U$28.7 13.88,97.98 JP10.1
AN6  (via drill 0.6)
  Top 0.305: IC5.79 49.94,58.62 49.94,72.1 v49.51,72.53
  Bottom 0.305: v49.51,72.53 SV2.12
AN7  (via drill 0.9)
  Top 0.305: IC5.81 48.63,80.21 53.12,84.7 v53.12,84.83 53.12,90.24 R11.2
  Top 0.508: X2.2 49.69,104.13 53.5,100.32 53.5,95.77 C26.1 53.41,90.53 R11.2
AN13  (via drill 0.6)
  Top 0.305: IC5.78 50.58,74.35 v50.58,75.68
  Bottom 0.305: SV2.11 38.64,81.78 39.91,83.05 43.21,83.05 v50.58,75.68
AN15  (via drill 0.9)
  Top 0.305: IC5.82 47.98,80.19 v42.58,85.59 39.91,88.26 39.91,90.44 R10.2
  Top 0.508: X2.5 39.93,96.92 C6.1 39.88,95.66 R10.2
B
  Top 0.305: R15.1 59.47,18.66 58.2,17.39 58.2,10.1 LED1.9
BKGD
  Top 0.305: IC5.23 60.98,35.31 69.37,26.92 JP1.1
C
  Top 0.305: R9.1 55.03,19.8 55.66,19.17 55.66,10.1 LED1.8
CANH0  (via drill 0.9)
  Top 0.381: S1.5 22.9,53.84
  Top 0.635: IC8.7 20.21,42.43 17.69,44.95 17.69,47.44 X5.3 17.51,53.84 v17.69,53.84 | S1.5 22.36,53.84 v17.69,53.84 | v17.69,53.84 17.69,63.95
  Top 0.762: 17.69,63.95 X6.3
CANH1  (via drill 0.9)
  Top 0.381: 29.75,21.46 28.46,21.46 S2.5 29.85,21.55 | 24.16,31.74 24.04,31.74 22.79,31.74 IC6.7
  Top 0.635: 29.75,21.46 31.66,19.55 31.66,7.99 28.35,4.69 21.11,4.69 18.96,6.85 v18.96,13.2 18.91,13.2 X1.3 | X3.3 19.65,34.22 21.5,36.06 23.78,36.06 24.92,34.92 24.92,32.5 24.16,31.74 | 29.85,21.55 31.66,23.36 31.66,25.77 29.37,28.06 26.07,28.06 24.92,29.2 24.92,30.85 24.04,31.74
CANL0  (via drill 0.9)
  Top 0.381: X5.4 13.11,50.71 13.11,54.6 | 13.24,61.84 13.24,64 11.86,65.38 X6.4 11.86,66.68 13.62,68.44 v20.23,68.44
  Top 0.635: IC8.6 24.69,43.7 25.31,44.31 25.31,52.57 26.85,54.11 S1.2 30.02,54.11 32.42,56.51 32.42,67.43 27.85,72 23.91,72 20.35,68.44 v20.23,68.44 | 13.11,54.6 13.11,61.71 13.24,61.84
CANL1  (via drill 0.9)
  Top 0.381: X1.4 13.11,17.69 13.11,21.46 | X3.4 13.11,31.69 13.11,28.95 | 22.27,21.46 S2.2
  Top 0.635: 13.11,21.46 13.11,25.93 | 13.11,25.93 13.11,28.95 | 22.27,21.46 19.59,21.46 17.3,23.74 v17.3,25.9 | IC6.6 19.75,33.04 17.3,30.6 v17.3,25.9 | 13.11,25.93 13.14,25.9 v17.3,25.9
D
  Top 0.305: R5.1 50.58,17.72 LED1.5
E
  Top 0.305: R6.1 52.74,18.1 LED1.4
EXTAL
  Top 0.305: IC5.46 71.15,50.28 72.04,49.4 72.04,45.61 Q2.1 72.15,45.34 C20.2
F
  Top 0.305: R16.1 61.87,19.79 59.47,17.39 LED1.2
G
  Top 0.305: R14.1 57.18,16.7 LED1.3
GM1  (via drill 0.9)
  Top 0.381: U$3.6 75.42,68.77 80.17,73.52 v85.38,73.52 85.39,73.52 U$18.P$1
GM2  (via drill 0.9)
  Top 0.381: U$3.8 71.15,69.43 71.15,69.46 v74.96,73.27 75,73.27 U$16.P$1
GM3  (via drill 0.6, 0.9)
  Top 0.381: U$3.11 65.74,67.48 v65.18,66.92 | v67.72,73.14 67.72,76.07 U$14.P$1
  Bottom 0.381: v65.18,66.92 65.18,70.99 v67.72,73.14
GM4  (via drill 0.9)
  Top 0.381: U$3.3 74.99,66.82 | 80.75,72.13 94.36,72.13 | 94.36,72.13 94.39,72.13 v95.79,73.52 | 94.36,72.13 U$19.P$1
  Top 0.406: 74.99,66.82 75.46,66.82 75.96,67.33 80.75,72.13
GM5  (via drill 0.9)
  Top 0.381: U$11.3 99.28,66.81 99.28,66.86 v105.95,73.52 106,73.52 U$20.P$1
GND_FAULT_MONITOR
  Top 0.305: IC5.71 55.13,79.86 64.04,88.76 64.04,101.78 U$13.P$8
GND_MST  (via drill 0.6)
  Top 0.305: C7.2 58.38,62.76 IC5.66 58.38,55.92 | C10.1 50.48,32.88 52.48,32.88 55.13,35.53 IC5.14 55.13,39.22 | IC5.44 IC5.45 64.66,49.63 | IC5.40 64.51,46.38 63.41,47.49 | 63.41,47.49 63.41,48.38 64.66,49.63 | 64.66,49.63 58.38,55.92 | 55.13,39.22 63.41,47.49 | 51.21,43.13 IC5.106 42.67,43.13 40.44,40.91 C9.2 | 51.21,43.13 55.13,39.22 | IC5.97 49.21,48.99 49.44,48.76 49.44,44.91 51.21,43.13 | 58.38,55.92 58.16,56.13 IC5.86 IC5.85 43.11,58.53 C25.2
  Top 0.381: U$11.13 U$11.12 81.71,66.81 | U$11.9 U$11.10 82.12,68.11 81.69,67.68 81.69,66.82 81.71,66.81 | U$11.4 U$11.5 87.74,68.11 87.41,68.44 87.41,69.08 87.74,69.41 U$11.7 98.02,69.41 v100.24,71.62 | 45.87,98.91 X2.4 | U$3.7 74.23,69.99 v75.47,71.24 | v80.68,65.78 81.71,66.81
  Top 0.508: R11.1 51.44,95.61 C26.2 50.22,94.39 C5.1 45.63,94.39 | R10.1 41.83,90.51 C6.2 43.14,94.39 45.63,94.39 | R7.1 98.3,47.01 C4.2 | 45.87,98.91 44.74,97.78 44.74,95.28 45.63,94.39
  Top 0.635: C15.2 80.72,8.81 IC3.4 78.31,11.59 v77.38,10.66 | C21.2 71.03,33.88 v71.03,36.06 | C8.1 78.63,58.81 C11.1 78.63,45.37 C20.1 78.61,40.96 C22.2 76.49,39.49 v74.84,41.14 | C3.2 98.87,56.49 101.51,56.49 101.51,56.38 | C4.2 100.66,47.91 101.51,48.76 101.51,51.55 | 101.51,51.55 101.51,56.38 | U$10.1 89.49,50.07 90.08,50.66 95.28,50.66 96.17,51.55 101.51,51.55 | C1.2 24.8,70.22 v22.51,67.94 | C2.2 23.01,6.22 v21.75,7.49 | IC6.2 32.74,31.77 C12.2 32.95,30.44 v35.21,28.19 | IC6.8 21.02,30.5 v19.97,29.46 | IC8.2 31.13,42.43 31.4,42.16 32.84,42.16 C29.2 29.94,38.98 v29.88,38.98 26.7,38.98 24.53,41.16 IC8.8 | R12.1 101.83,56.06 101.51,56.38 | LED2.C 105.34,51.55 101.51,51.55 | C7.2 57.98,65.18 v58.58,65.78 | C24.1 18.07,83.3
  Top 1.27: U$14.P$3 72.27,74.13 v71.03,72.89 v70.01,71.87 | U$18.P$3 95.41,78.94 v95.41,79.49 | U$16.P$3 85.25,78.92 v85.25,79.49 | U$19.P$3 102.94,74.32 v101.51,72.89 v100.24,71.62 | U$20.P$3 113.18,73.13 v112.94,72.89 v111.67,71.62 | C13.2 125.32,65.59 U$27.1 115.79,56.06 R12.1 | C28.2 114.87,41.4 C33.2 | U$28.2 12.55,83.46 C24.1
  Bottom 0.381: v80.68,65.78 80.42,65.78
  Bottom 0.635: v21.75,7.49 21.75,7.87
  Bottom 1.27: v95.41,79.49 95.16,79.75 | v85.25,79.49 85,79.75 85,81.78
  other vias: 84.49,78.22 94.65,78.22
  pour Bottom (isolate 0.406): 37.88,110.99 118.02,110.99 125.64,103.37 125.64,34.1 125.45,33.92 83.73,34.03 80.41,30.61 80.41,3.05 78.87,3.04 14.49,3.04 3.72,13.82 3.72,71.02 3.68,84.95 33.18,84.98 37.96,90.06
  pour Top: 46.51,55.87 46.51,40.25 47.66,39.11 63.53,39.11 64.29,39.87 64.29,56.13 63.53,56.89 47.53,56.89
GND_USB  (via drill 0.6)
  Top 0.381: C18.1 103.76,20.95 C17.1 103.86,20.96 C16.1 107.8,17.06 107.86,17.01 107.86,12.16 C19.1 106.78,12.12 103.54,8.88 | IC2.26 IC2.25 100.1,12.56 v99.47,11.93 99.47,10.66 100.17,9.96 IC2.21 102.97,9.96 103.54,9.39 103.54,8.88 | 103.54,8.88 103.54,8.5 103.05,8.01 IC2.18 100.51,8.01 95.79,3.29 90.2,3.29 87.41,6.09 87.41,6.96 C14.2 87.54,7.11 87.54,9.66 | 87.54,9.66 IC3.5 | IC2.7 88.49,10.61 87.54,9.66
  other vias: 107.86,16.76 87.54,9.77
  pour Bottom (isolate 0.406): 125.64,28.44 125.64,11.55 117.16,3.04 85.76,2.91 85.76,26.33 87.74,28.32
HV_GND
  Top 1.27: 17.35,91.32 C27.1 20.89,91.25 C32.2 | C30.1 10.32,103.88 C35.2
  pour Bottom (isolate 0.406): 3.59,90.16 30.26,90.16 33.31,93.21 33.31,107.81 30.39,110.99 10.07,110.99 3.72,104.64 3.72,90.67
IGNITION
  Top 0.305: IC5.73 53.83,80.33 62.77,89.27 62.77,105.59 U$13.P$9
MCR1
  Top 1.27: D4.C 84.59,103.24 U$13.P$5
MCR2
  Top 1.27: D3.C 80.4,106.19 U$13.P$6
MCR3
  Top 1.27: D2.C 74.43,101.46 U$13.P$7
MCR4
  Top 1.27: U$13.P$4 99.75,97 D5.C
MCR5
  Top 1.27: D6.C 104.56,97.27 U$13.P$3
N$2
  Top 0.508: 90.76,43.93 88.55,43.93 R8.1 | R7.2 91.35,43.93 90.76,43.93 | 90.76,43.93 U$10.2
N$3
  Top 0.305: R17.1 63.65,20.3 60.87,17.52 60.87,9.97 LED1.10
N$5
  Top 0.305: 97.7,50.03 98.08,50.03 C4.1
  Top 0.508: U$10.4 96.11,48.45 97.7,50.03
N$7
  Top 0.635: U$10.6 92.03,52.65 92.49,52.19 94.52,52.19 96.04,53.71 98,53.71 C3.1
N$8
  Top 0.635: R13.1 108.15,45.9 LED2.A
N$12
  Top 1.27: JP9.1 J1.P$11
N$13
  Top 1.27: J1.P$9 27.72,104.51 16.92,104.51 16.42,105.02 JP9.2
N$18
  Top 0.762: R3.2 22.25,11.03 C2.1 28.29,11.24 R4.2
N$19
  Top 0.762: R3.1 22.37,14.46 S2.1
N$20
  Top 0.762: R4.1 28.37,14.41 S2.4
N$21  (via drill 0.9)
  Top 0.381: IC2.15 108.34,6.06 v109.76,7.49 118.47,16.2 X7.D+
N$22  (via drill 0.9)
  Top 0.381: IC2.16 106.95,6.71 v110.52,10.28 116.49,16.25 X7.D-
N$23
  Top 0.381: IC2.23 103.38,11.26 103.79,11.68 103.79,16.63 102.52,17.9 97.08,17.9 R1.1
N$24
  Top 0.381: R1.2 89.33,21.13 TX_LED.C
N$25
  Top 0.381: IC2.22 104.12,10.61 104.93,11.42 104.93,17.14 102.9,19.17 97.44,19.17 95.79,20.82 95.79,22.24 R2.1
N$26
  Top 0.381: R2.2 89.5,24.13 RX_LED.C
N$27
  Top 0.381: IC2.17 104.95,7.36 C19.2
N$29
  Top 0.762: R31.2 28.67,65.32 C1.1 22.62,65.28 R32.2
N$31
  Top 0.305: R21.1 48.17,15.05 LED1.7
N$34
  Top 0.762: R31.1 28.63,61.53 S1.1
N$37
  Top 0.762: R32.1 S1.4
N$47  (via drill 0.9)  (1 unrouted)
  Top 0.381: U$3.9 70.44,68.77 71.74,67.48 | 71.74,67.48 U$3.4 | 71.09,66.82 U$3.12 | 71.74,67.48 71.09,66.82 | 71.09,66.82 72.39,65.53 U$3.1 77.5,65.53 82.96,70.99 85.25,70.99 86.39,69.84 86.39,66.67 87.55,65.51 U$11.1 93.3,61.41 U$10.5
  other vias: 93.25,61.46
N$62
  Top 1.27: U$20.P$4 D6.A
N$63
  Top 1.27: D5.A 100.64,86.76 U$19.P$4
N$64
  Top 1.27: D4.A 90.3,86.86 U$18.P$4
N$65
  Top 1.27: D3.A 80.13,86.57 U$16.P$4
N$66
  Top 1.27: D2.A 69.97,86.84 U$14.P$4
PA0  (via drill 0.6)
  Top 0.305: IC5.57 64.23,60.51 65.06,61.33 70.9,61.33 v71.03,61.46 | v91.6,65.4 90.84,66.16 U$11.2
  Bottom 0.305: v71.03,61.46 87.66,61.46 v91.6,65.4
PA1  (via drill 0.6)
  Top 0.305: v76.99,67.05 76.12,66.18 U$3.2 | IC5.58 63.58,61.63 64.68,62.73 v68.49,62.73
  Bottom 0.305: v68.49,62.73 72.8,67.05 v76.99,67.05
PA2  (via drill 0.6)
  Top 0.305: v72.04,68.7 72.62,68.12 U$3.5 | IC5.59 62.93,63.4 63.91,64.38 v65.44,64.38
  Bottom 0.305: v72.04,68.7 71.15,68.7 66.83,64.38 v65.44,64.38
PA3
  Top 0.305: IC5.60 62.28,63.89 64.04,65.65 66.83,65.65 67.34,66.16 68.61,66.16 U$3.13
PA4
  Top 0.305: IC5.61 61.63,65.75 64.01,68.12 U$3.10
PE0  (via drill 0.6, 0.9)
  Top 0.305: IC5.56 67.34,58.07 v67.34,58.54 | v90.08,58.92 90.76,58.24 U$10.7
  Bottom 0.305: v67.34,58.54 67.72,58.92 v90.08,58.92
PJ0
  Top 0.305: IC5.22 60.33,34.69 63.66,31.36 63.66,29.65 R17.2
PJ1
  Top 0.305: IC5.21 59.68,33.94 61.88,31.74 61.88,23.43 R16.2
PK4
  Top 0.305: IC5.20 59.03,30.08 R15.2
PK5
  Top 0.305: IC5.19 58.38,32.05 57.18,30.85 R14.2
PM6  (via drill 0.6)
  Top 0.305: IC5.88 42.09,54.84 41.82,55.11 v41.82,58.92
  Bottom 0.305: v41.82,58.92 41.82,60.19 45.12,63.49 45.12,73.4 42.45,76.06 SV2.8
PM7  (via drill 0.6)
  Top 0.305: v42.96,56.76 42.96,55.67 43,55.58 43.09,55.49 IC5.87
  Bottom 0.305: SV2.10 41.82,78.61 46.13,74.29 46.13,61.97 42.96,58.79 v42.96,56.76
PS0  (via drill 0.6)
  Top 0.305: v40.55,60.32 40.55,54.86 41.22,54.19 IC5.89
  Bottom 0.305: v40.55,60.32 40.55,61.84 44.1,65.4 44.1,71.24 41.82,73.52 SV2.6
PS1  (via drill 0.6)
  Top 0.305: v39.28,58.92 39.28,54.35 40.09,53.53 IC5.90
  Bottom 0.305: v39.28,58.92 39.28,63.37 43.09,67.18 43.09,69.71 41.82,70.99 SV2.4
PS2  (via drill 0.6)
  Top 0.305: v38.01,60.32 38.01,53.84 38.96,52.88 IC5.91
  Bottom 0.305: v38.01,60.32 38.01,64.63 41.18,67.81 SV2.2
PS3  (via drill 0.6)
  Top 0.305: v36.74,59.3 36.74,53.59 38.09,52.24 IC5.92
  Bottom 0.305: SV2.1 36.74,66.54 v36.74,59.3
PS4  (via drill 0.6)
  Top 0.305: IC5.93 37.09,51.59 35.47,53.21 v35.47,62.09
  Bottom 0.305: SV2.3 35.47,67.81 v35.47,62.09
PS5  (via drill 0.6)
  Top 0.305: IC5.94 35.83,50.94 34.2,52.57 v34.2,60.82
  Bottom 0.305: SV2.5 34.2,69.08 v34.2,60.82
PS6  (via drill 0.6)
  Top 0.305: v32.8,52.82 32.8,52.09 34.6,50.28 IC5.95
  Bottom 0.305: SV2.7 38.64,75.94 32.8,70.1 v32.8,52.82
PS7  (via drill 0.6)
  Top 0.305: IC5.96 33.32,49.63 v31.66,51.3
  Bottom 0.305: v31.66,51.3 31.66,71.62 SV2.9
PT4
  Top 0.305: IC5.15 55.78,35.17 51.98,31.36 48.93,31.36 48.17,30.6 R21.2
PT5
  Top 0.305: IC5.16 56.43,34.8 51.21,29.58 50.64,29.58 R5.2
PT6
  Top 0.305: IC5.17 57.08,34.43 52.74,30.09 R6.2
PT7
  Top 0.305: IC5.18 57.73,32.34 R9.2
PWM_TEMP_CTRL  (via drill 0.6)
  Top 0.305: IC5.4 48.63,36.14 v47.66,35.17 | v52.36,63.75 52.36,81.4 60.87,89.91 60.87,105.4 U$13.P$11
  Bottom 0.305: v47.66,35.17 52.36,39.87 v52.36,63.75
RST  (via drill 0.6)
  Top 0.305: IC5.42 68.42,47.69 v68.49,47.62 | v76.11,28.44 76.11,27.04 JP1.4
  Bottom 0.305: v68.49,47.62 68.49,36.06 v76.11,28.44
RXCAN0  (via drill 0.9)
  Top 0.305: IC5.99 33.63,47.69 v32.16,46.22 30.91,44.97 IC8.4
RXCAN1  (via drill 0.9)
  Top 0.305: IC5.103 41.7,45.09 v32.16,35.55 30.93,34.31 IC6.4
RXD_MST  (via drill 0.6, 0.9)
  Top 0.305: IC5.33 67.66,41.84 69.12,40.38 v69.12,32.76 | v76.49,17.14 79.41,14.22 80.64,14.22 IC3.2
  Bottom 0.305: v69.12,32.76 76.49,25.39 v76.49,17.14
RXD_USB  (via drill 0.9)
  Top 0.381: IC2.5 89.08,11.91 v89.06,11.93 88.17,12.82 85.65,12.82 IC3.6
TXCAN0  (via drill 0.9)
  Top 0.305: IC8.1 26.81,41.16 26.32,41.65 26.32,45.97 v27.72,47.36 28.69,48.34 IC5.98
TXCAN1  (via drill 0.9)
  Top 0.305: IC6.1 26.67,30.5 26.07,31.11 26.07,35.04 v27.85,36.82 32.42,36.82 41.33,45.74 IC5.102
TXD_MST  (via drill 0.6, 0.9)
  Top 0.305: IC5.32 67.3,41.19 67.85,40.63 v67.85,31.36 | v74.45,14.85 76.44,12.87 IC3.3
  Bottom 0.305: v67.85,31.36 74.45,24.88 v74.45,14.85
TXD_USB  (via drill 0.9)
  Top 0.381: IC2.1 88.72,14.51 v88.42,14.22 88.3,14.09 85.65,14.09 IC3.7
VDD
  Top 0.305: IC5.65 59.03,61.4 59.85,62.22 59.85,63.13 C7.1
VDDF
  Top 0.305: IC5.13 54.48,35.9 53.25,34.66 48.8,34.66 48.17,34.03 48.17,33.3 C10.2
VDDPLL
  Top 0.305: IC5.48 67.37,51.59 69.12,53.33 69.12,57.4 70.64,58.92 76.81,58.92 C8.2
VIN
  Top 1.27: 120.38,69.08 120.38,67 U$27.2 | 120.38,69.08 120.38,101.9 U$13.P$10 U$13.P$12 | 120.38,69.08 C13.1
VOADJUST
  Top 1.27: R12.2 109.13,53.71 U$27.4
VS
  Top 1.27: JP7.2 21.75,76.83 C24.2 12.81,80.66 U$28.1
VUSB
  Top 0.381: 112.27,22.86 C16.2 106.96,23.7 U$1.2
  Top 0.406: 112.27,22.86 114.62,22.86 116.49,20.99 X7.VBUS
XTAL
  Top 0.305: IC5.47 71.17,50.94 72.04,51.81 72.04,54.95 | 72.04,54.95 Q2.2 | 72.04,54.95 76.69,54.95 C11.2

### Text on the board
tPlace: Formule Électrique | BMS Maître V1.0 | -5V | 0V | +5V | CH1 | CH2 | 78 | 79 | 96 | 87 | 95 | 88 | DC/DC ISO | 94 | 89 | GM3 | GM2 | GM1 | GM4 | GM5 | 93 | 90 | 92 | 91 | WDO | CANL0 | WDI | OFF/ON | TX0 | CANH0 | RX0 | PWR | GND | TX1 | RX1 | VDD | CANL1 | BKGD | RXD | GND | RST | VDD | ON/OFF | TXD | RX | TX | D- | Gracieuseté | D+ | CANH1 | labocircuit.ca